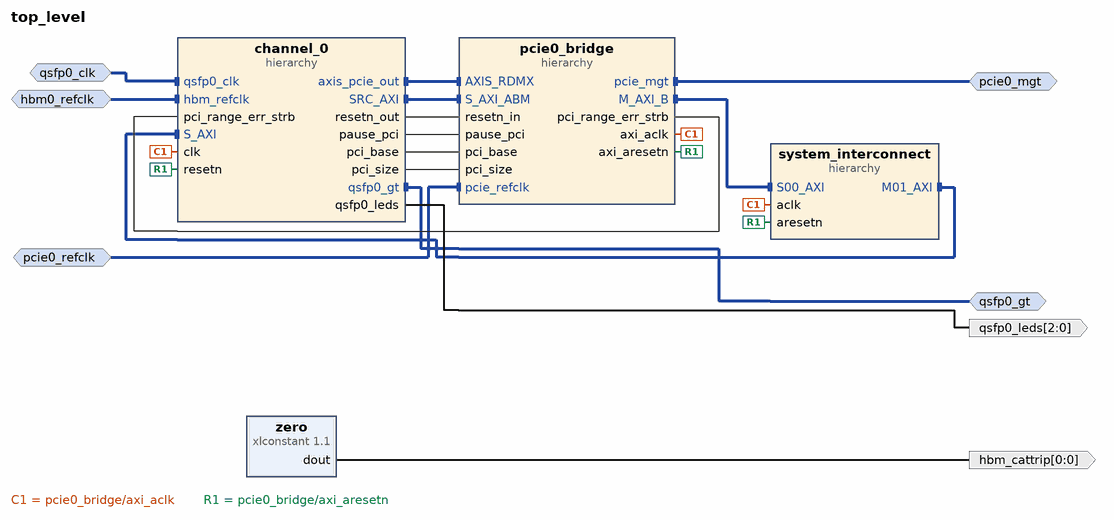
[diagram p0: block diagram of the top level]
# Vivado block design top_level, xcu55c-fsvh2892-2L-e, Vivado 2021.1
create_bd_design top_level

create_bd_intf_port -mode Slave -vlnv xilinx.com:interface:diff_clock_rtl:1.0 pcie0_refclk
create_bd_intf_port -mode Master -vlnv xilinx.com:interface:pcie_7x_mgt_rtl:1.0 pcie0_mgt
create_bd_intf_port -mode Slave -vlnv xilinx.com:interface:diff_clock_rtl:1.0 qsfp0_clk
set_property -dict {CONFIG.FREQ_HZ 161132812} [get_bd_intf_ports qsfp0_clk]
create_bd_intf_port -mode Master -vlnv xilinx.com:interface:gt_rtl:1.0 qsfp0_gt
create_bd_intf_port -mode Slave -vlnv xilinx.com:interface:diff_clock_rtl:1.0 hbm0_refclk
create_bd_port -dir O -from 0 -to 0 hbm_cattrip
create_bd_port -dir O -from 2 -to 0 qsfp0_leds

create_bd_cell -type hier pcie0_bridge
create_bd_cell -type hier system_interconnect
create_bd_cell -type ip -vlnv xilinx.com:ip:xlconstant:1.1 zero
set_property -dict {CONFIG.CONST_VAL 0} [get_bd_cells zero]
create_bd_cell -type hier channel_0

# ---- hierarchy /pcie0_bridge ----
current_bd_instance /pcie0_bridge
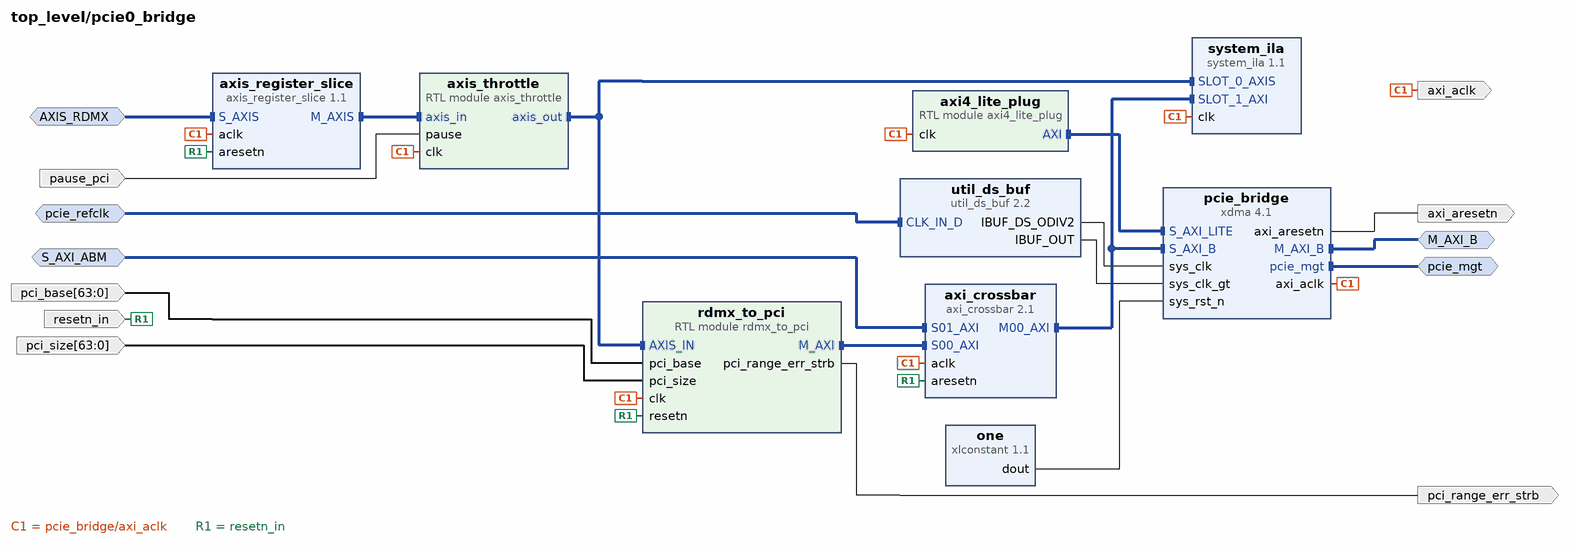
[diagram p1: block diagram inside /pcie0_bridge]
create_bd_intf_pin -mode Master -vlnv xilinx.com:interface:pcie_7x_mgt_rtl:1.0 pcie_mgt
create_bd_intf_pin -mode Slave -vlnv xilinx.com:interface:diff_clock_rtl:1.0 pcie_refclk
create_bd_intf_pin -mode Master -vlnv xilinx.com:interface:aximm_rtl:1.0 M_AXI_B
create_bd_intf_pin -mode Slave -vlnv xilinx.com:interface:axis_rtl:1.0 AXIS_RDMX
create_bd_intf_pin -mode Slave -vlnv xilinx.com:interface:aximm_rtl:1.0 S_AXI_ABM
create_bd_pin -dir O axi_aclk
create_bd_pin -dir O axi_aresetn
create_bd_pin -dir I resetn_in
create_bd_pin -dir O pci_range_err_strb
create_bd_pin -dir I pause_pci
create_bd_pin -dir I -from 63 -to 0 pci_base
create_bd_pin -dir I -from 63 -to 0 pci_size

create_bd_cell -type ip -vlnv xilinx.com:ip:axi_crossbar:2.1 axi_crossbar
set_property -dict [list \
  CONFIG.M00_A01_BASE_ADDR 0xffffffffffffffff \
  CONFIG.M00_A02_BASE_ADDR 0xffffffffffffffff \
  CONFIG.M00_A03_BASE_ADDR 0xffffffffffffffff \
  CONFIG.M00_A04_BASE_ADDR 0xffffffffffffffff \
  CONFIG.M00_A05_BASE_ADDR 0xffffffffffffffff \
  CONFIG.M00_A06_BASE_ADDR 0xffffffffffffffff \
  CONFIG.M00_A07_BASE_ADDR 0xffffffffffffffff \
  CONFIG.M00_A08_BASE_ADDR 0xffffffffffffffff \
  CONFIG.M00_A09_BASE_ADDR 0xffffffffffffffff \
  CONFIG.M00_A10_BASE_ADDR 0xffffffffffffffff \
  CONFIG.M00_A11_BASE_ADDR 0xffffffffffffffff \
  CONFIG.M00_A12_BASE_ADDR 0xffffffffffffffff \
  CONFIG.M00_A13_BASE_ADDR 0xffffffffffffffff \
  CONFIG.M00_A14_BASE_ADDR 0xffffffffffffffff \
  CONFIG.M00_A15_BASE_ADDR 0xffffffffffffffff \
  CONFIG.M00_S00_READ_CONNECTIVITY 0 \
  CONFIG.M00_S00_WRITE_CONNECTIVITY 1 \
  CONFIG.M00_S01_READ_CONNECTIVITY 1 \
  CONFIG.M00_S01_WRITE_CONNECTIVITY 0 \
  CONFIG.M01_A00_ADDR_WIDTH 0 \
  CONFIG.M01_A00_BASE_ADDR 0xffffffffffffffff \
  CONFIG.M01_A01_BASE_ADDR 0xffffffffffffffff \
  CONFIG.M01_A02_BASE_ADDR 0xffffffffffffffff \
  CONFIG.M01_A03_BASE_ADDR 0xffffffffffffffff \
  CONFIG.M01_A04_BASE_ADDR 0xffffffffffffffff \
  CONFIG.M01_A05_BASE_ADDR 0xffffffffffffffff \
  CONFIG.M01_A06_BASE_ADDR 0xffffffffffffffff \
  CONFIG.M01_A07_BASE_ADDR 0xffffffffffffffff \
  CONFIG.M01_A08_BASE_ADDR 0xffffffffffffffff \
  CONFIG.M01_A09_BASE_ADDR 0xffffffffffffffff \
  CONFIG.M01_A10_BASE_ADDR 0xffffffffffffffff \
  CONFIG.M01_A11_BASE_ADDR 0xffffffffffffffff \
  CONFIG.M01_A12_BASE_ADDR 0xffffffffffffffff \
  CONFIG.M01_A13_BASE_ADDR 0xffffffffffffffff \
  CONFIG.M01_A14_BASE_ADDR 0xffffffffffffffff \
  CONFIG.M01_A15_BASE_ADDR 0xffffffffffffffff \
  CONFIG.M02_A00_ADDR_WIDTH 0 \
  CONFIG.M02_A00_BASE_ADDR 0xffffffffffffffff \
  CONFIG.M02_A01_BASE_ADDR 0xffffffffffffffff \
  CONFIG.M02_A02_BASE_ADDR 0xffffffffffffffff \
  CONFIG.M02_A03_BASE_ADDR 0xffffffffffffffff \
  CONFIG.M02_A04_BASE_ADDR 0xffffffffffffffff \
  CONFIG.M02_A05_BASE_ADDR 0xffffffffffffffff \
  CONFIG.M02_A06_BASE_ADDR 0xffffffffffffffff \
  CONFIG.M02_A07_BASE_ADDR 0xffffffffffffffff \
  CONFIG.M02_A08_BASE_ADDR 0xffffffffffffffff \
  CONFIG.M02_A09_BASE_ADDR 0xffffffffffffffff \
  CONFIG.M02_A10_BASE_ADDR 0xffffffffffffffff \
  CONFIG.M02_A11_BASE_ADDR 0xffffffffffffffff \
  CONFIG.M02_A12_BASE_ADDR 0xffffffffffffffff \
  CONFIG.M02_A13_BASE_ADDR 0xffffffffffffffff \
  CONFIG.M02_A14_BASE_ADDR 0xffffffffffffffff \
  CONFIG.M02_A15_BASE_ADDR 0xffffffffffffffff \
  CONFIG.M03_A00_ADDR_WIDTH 0 \
  CONFIG.M03_A00_BASE_ADDR 0xffffffffffffffff \
  CONFIG.M03_A01_BASE_ADDR 0xffffffffffffffff \
  CONFIG.M03_A02_BASE_ADDR 0xffffffffffffffff \
  CONFIG.M03_A03_BASE_ADDR 0xffffffffffffffff \
  CONFIG.M03_A04_BASE_ADDR 0xffffffffffffffff \
  CONFIG.M03_A05_BASE_ADDR 0xffffffffffffffff \
  CONFIG.M03_A06_BASE_ADDR 0xffffffffffffffff \
  CONFIG.M03_A07_BASE_ADDR 0xffffffffffffffff \
  CONFIG.M03_A08_BASE_ADDR 0xffffffffffffffff \
  CONFIG.M03_A09_BASE_ADDR 0xffffffffffffffff \
  CONFIG.M03_A10_BASE_ADDR 0xffffffffffffffff \
  CONFIG.M03_A11_BASE_ADDR 0xffffffffffffffff \
  CONFIG.M03_A12_BASE_ADDR 0xffffffffffffffff \
  CONFIG.M03_A13_BASE_ADDR 0xffffffffffffffff \
  CONFIG.M03_A14_BASE_ADDR 0xffffffffffffffff \
  CONFIG.M03_A15_BASE_ADDR 0xffffffffffffffff \
  CONFIG.M04_A00_ADDR_WIDTH 0 \
  CONFIG.M04_A00_BASE_ADDR 0xffffffffffffffff \
  CONFIG.M04_A01_BASE_ADDR 0xffffffffffffffff \
  CONFIG.M04_A02_BASE_ADDR 0xffffffffffffffff \
  CONFIG.M04_A03_BASE_ADDR 0xffffffffffffffff \
  CONFIG.M04_A04_BASE_ADDR 0xffffffffffffffff \
  CONFIG.M04_A05_BASE_ADDR 0xffffffffffffffff \
  CONFIG.M04_A06_BASE_ADDR 0xffffffffffffffff \
  CONFIG.M04_A07_BASE_ADDR 0xffffffffffffffff \
  CONFIG.M04_A08_BASE_ADDR 0xffffffffffffffff \
  CONFIG.M04_A09_BASE_ADDR 0xffffffffffffffff \
  CONFIG.M04_A10_BASE_ADDR 0xffffffffffffffff \
  CONFIG.M04_A11_BASE_ADDR 0xffffffffffffffff \
  CONFIG.M04_A12_BASE_ADDR 0xffffffffffffffff \
  CONFIG.M04_A13_BASE_ADDR 0xffffffffffffffff \
  CONFIG.M04_A14_BASE_ADDR 0xffffffffffffffff \
  CONFIG.M04_A15_BASE_ADDR 0xffffffffffffffff \
  CONFIG.M05_A00_ADDR_WIDTH 0 \
  CONFIG.M05_A00_BASE_ADDR 0xffffffffffffffff \
  CONFIG.M05_A01_BASE_ADDR 0xffffffffffffffff \
  CONFIG.M05_A02_BASE_ADDR 0xffffffffffffffff \
  CONFIG.M05_A03_BASE_ADDR 0xffffffffffffffff \
  CONFIG.M05_A04_BASE_ADDR 0xffffffffffffffff \
  CONFIG.M05_A05_BASE_ADDR 0xffffffffffffffff \
  CONFIG.M05_A06_BASE_ADDR 0xffffffffffffffff \
  CONFIG.M05_A07_BASE_ADDR 0xffffffffffffffff \
  CONFIG.M05_A08_BASE_ADDR 0xffffffffffffffff \
  CONFIG.M05_A09_BASE_ADDR 0xffffffffffffffff \
  CONFIG.M05_A10_BASE_ADDR 0xffffffffffffffff \
  CONFIG.M05_A11_BASE_ADDR 0xffffffffffffffff \
  CONFIG.M05_A12_BASE_ADDR 0xffffffffffffffff \
  CONFIG.M05_A13_BASE_ADDR 0xffffffffffffffff \
  CONFIG.M05_A14_BASE_ADDR 0xffffffffffffffff \
  CONFIG.M05_A15_BASE_ADDR 0xffffffffffffffff \
  CONFIG.M06_A00_ADDR_WIDTH 0 \
  CONFIG.M06_A00_BASE_ADDR 0xffffffffffffffff \
  CONFIG.M06_A01_BASE_ADDR 0xffffffffffffffff \
  CONFIG.M06_A02_BASE_ADDR 0xffffffffffffffff \
  CONFIG.M06_A03_BASE_ADDR 0xffffffffffffffff \
  CONFIG.M06_A04_BASE_ADDR 0xffffffffffffffff \
  CONFIG.M06_A05_BASE_ADDR 0xffffffffffffffff \
  CONFIG.M06_A06_BASE_ADDR 0xffffffffffffffff \
  CONFIG.M06_A07_BASE_ADDR 0xffffffffffffffff \
  CONFIG.M06_A08_BASE_ADDR 0xffffffffffffffff \
  CONFIG.M06_A09_BASE_ADDR 0xffffffffffffffff \
  CONFIG.M06_A10_BASE_ADDR 0xffffffffffffffff \
  CONFIG.M06_A11_BASE_ADDR 0xffffffffffffffff \
  CONFIG.M06_A12_BASE_ADDR 0xffffffffffffffff \
  CONFIG.M06_A13_BASE_ADDR 0xffffffffffffffff \
  CONFIG.M06_A14_BASE_ADDR 0xffffffffffffffff \
  CONFIG.M06_A15_BASE_ADDR 0xffffffffffffffff \
  CONFIG.M07_A00_ADDR_WIDTH 0 \
  CONFIG.M07_A00_BASE_ADDR 0xffffffffffffffff \
  CONFIG.M07_A01_BASE_ADDR 0xffffffffffffffff \
  CONFIG.M07_A02_BASE_ADDR 0xffffffffffffffff \
  CONFIG.M07_A03_BASE_ADDR 0xffffffffffffffff \
  CONFIG.M07_A04_BASE_ADDR 0xffffffffffffffff \
  CONFIG.M07_A05_BASE_ADDR 0xffffffffffffffff \
  CONFIG.M07_A06_BASE_ADDR 0xffffffffffffffff \
  CONFIG.M07_A07_BASE_ADDR 0xffffffffffffffff \
  CONFIG.M07_A08_BASE_ADDR 0xffffffffffffffff \
  CONFIG.M07_A09_BASE_ADDR 0xffffffffffffffff \
  CONFIG.M07_A10_BASE_ADDR 0xffffffffffffffff \
  CONFIG.M07_A11_BASE_ADDR 0xffffffffffffffff \
  CONFIG.M07_A12_BASE_ADDR 0xffffffffffffffff \
  CONFIG.M07_A13_BASE_ADDR 0xffffffffffffffff \
  CONFIG.M07_A14_BASE_ADDR 0xffffffffffffffff \
  CONFIG.M07_A15_BASE_ADDR 0xffffffffffffffff \
  CONFIG.M08_A00_ADDR_WIDTH 0 \
  CONFIG.M08_A00_BASE_ADDR 0xffffffffffffffff \
  CONFIG.M08_A01_BASE_ADDR 0xffffffffffffffff \
  CONFIG.M08_A02_BASE_ADDR 0xffffffffffffffff \
  CONFIG.M08_A03_BASE_ADDR 0xffffffffffffffff \
  CONFIG.M08_A04_BASE_ADDR 0xffffffffffffffff \
  CONFIG.M08_A05_BASE_ADDR 0xffffffffffffffff \
  CONFIG.M08_A06_BASE_ADDR 0xffffffffffffffff \
  CONFIG.M08_A07_BASE_ADDR 0xffffffffffffffff \
  CONFIG.M08_A08_BASE_ADDR 0xffffffffffffffff \
  CONFIG.M08_A09_BASE_ADDR 0xffffffffffffffff \
  CONFIG.M08_A10_BASE_ADDR 0xffffffffffffffff \
  CONFIG.M08_A11_BASE_ADDR 0xffffffffffffffff \
  CONFIG.M08_A12_BASE_ADDR 0xffffffffffffffff \
  CONFIG.M08_A13_BASE_ADDR 0xffffffffffffffff \
  CONFIG.M08_A14_BASE_ADDR 0xffffffffffffffff \
  CONFIG.M08_A15_BASE_ADDR 0xffffffffffffffff \
  CONFIG.M09_A00_ADDR_WIDTH 0 \
  CONFIG.M09_A00_BASE_ADDR 0xffffffffffffffff \
  CONFIG.M09_A01_BASE_ADDR 0xffffffffffffffff \
  CONFIG.M09_A02_BASE_ADDR 0xffffffffffffffff \
  CONFIG.M09_A03_BASE_ADDR 0xffffffffffffffff \
  CONFIG.M09_A04_BASE_ADDR 0xffffffffffffffff \
  CONFIG.M09_A05_BASE_ADDR 0xffffffffffffffff \
  CONFIG.M09_A06_BASE_ADDR 0xffffffffffffffff \
  CONFIG.M09_A07_BASE_ADDR 0xffffffffffffffff \
  CONFIG.M09_A08_BASE_ADDR 0xffffffffffffffff \
  CONFIG.M09_A09_BASE_ADDR 0xffffffffffffffff \
  CONFIG.M09_A10_BASE_ADDR 0xffffffffffffffff \
  CONFIG.M09_A11_BASE_ADDR 0xffffffffffffffff \
  CONFIG.M09_A12_BASE_ADDR 0xffffffffffffffff \
  CONFIG.M09_A13_BASE_ADDR 0xffffffffffffffff \
  CONFIG.M09_A14_BASE_ADDR 0xffffffffffffffff \
  CONFIG.M09_A15_BASE_ADDR 0xffffffffffffffff \
  CONFIG.M10_A00_ADDR_WIDTH 0 \
  CONFIG.M10_A00_BASE_ADDR 0xffffffffffffffff \
  CONFIG.M10_A01_BASE_ADDR 0xffffffffffffffff \
  CONFIG.M10_A02_BASE_ADDR 0xffffffffffffffff \
  CONFIG.M10_A03_BASE_ADDR 0xffffffffffffffff \
  CONFIG.M10_A04_BASE_ADDR 0xffffffffffffffff \
  CONFIG.M10_A05_BASE_ADDR 0xffffffffffffffff \
  CONFIG.M10_A06_BASE_ADDR 0xffffffffffffffff \
  CONFIG.M10_A07_BASE_ADDR 0xffffffffffffffff \
  CONFIG.M10_A08_BASE_ADDR 0xffffffffffffffff \
  CONFIG.M10_A09_BASE_ADDR 0xffffffffffffffff \
  CONFIG.M10_A10_BASE_ADDR 0xffffffffffffffff \
  CONFIG.M10_A11_BASE_ADDR 0xffffffffffffffff \
  CONFIG.M10_A12_BASE_ADDR 0xffffffffffffffff \
  CONFIG.M10_A13_BASE_ADDR 0xffffffffffffffff \
  CONFIG.M10_A14_BASE_ADDR 0xffffffffffffffff \
  CONFIG.M10_A15_BASE_ADDR 0xffffffffffffffff \
  CONFIG.M11_A00_ADDR_WIDTH 0 \
  CONFIG.M11_A00_BASE_ADDR 0xffffffffffffffff \
  CONFIG.M11_A01_BASE_ADDR 0xffffffffffffffff \
  CONFIG.M11_A02_BASE_ADDR 0xffffffffffffffff \
  CONFIG.M11_A03_BASE_ADDR 0xffffffffffffffff \
  CONFIG.M11_A04_BASE_ADDR 0xffffffffffffffff \
  CONFIG.M11_A05_BASE_ADDR 0xffffffffffffffff \
  CONFIG.M11_A06_BASE_ADDR 0xffffffffffffffff \
  CONFIG.M11_A07_BASE_ADDR 0xffffffffffffffff \
  CONFIG.M11_A08_BASE_ADDR 0xffffffffffffffff \
  CONFIG.M11_A09_BASE_ADDR 0xffffffffffffffff \
  CONFIG.M11_A10_BASE_ADDR 0xffffffffffffffff \
  CONFIG.M11_A11_BASE_ADDR 0xffffffffffffffff \
  CONFIG.M11_A12_BASE_ADDR 0xffffffffffffffff \
  CONFIG.M11_A13_BASE_ADDR 0xffffffffffffffff \
  CONFIG.M11_A14_BASE_ADDR 0xffffffffffffffff \
  CONFIG.M11_A15_BASE_ADDR 0xffffffffffffffff \
  CONFIG.M12_A00_ADDR_WIDTH 0 \
  CONFIG.M12_A00_BASE_ADDR 0xffffffffffffffff \
  CONFIG.M12_A01_BASE_ADDR 0xffffffffffffffff \
  CONFIG.M12_A02_BASE_ADDR 0xffffffffffffffff \
  CONFIG.M12_A03_BASE_ADDR 0xffffffffffffffff \
  CONFIG.M12_A04_BASE_ADDR 0xffffffffffffffff \
  CONFIG.M12_A05_BASE_ADDR 0xffffffffffffffff \
  CONFIG.M12_A06_BASE_ADDR 0xffffffffffffffff \
  CONFIG.M12_A07_BASE_ADDR 0xffffffffffffffff \
  CONFIG.M12_A08_BASE_ADDR 0xffffffffffffffff \
  CONFIG.M12_A09_BASE_ADDR 0xffffffffffffffff \
  CONFIG.M12_A10_BASE_ADDR 0xffffffffffffffff \
  CONFIG.M12_A11_BASE_ADDR 0xffffffffffffffff \
  CONFIG.M12_A12_BASE_ADDR 0xffffffffffffffff \
  CONFIG.M12_A13_BASE_ADDR 0xffffffffffffffff \
  CONFIG.M12_A14_BASE_ADDR 0xffffffffffffffff \
  CONFIG.M12_A15_BASE_ADDR 0xffffffffffffffff \
  CONFIG.M13_A00_ADDR_WIDTH 0 \
  CONFIG.M13_A00_BASE_ADDR 0xffffffffffffffff \
  CONFIG.M13_A01_BASE_ADDR 0xffffffffffffffff \
  CONFIG.M13_A02_BASE_ADDR 0xffffffffffffffff \
  CONFIG.M13_A03_BASE_ADDR 0xffffffffffffffff \
  CONFIG.M13_A04_BASE_ADDR 0xffffffffffffffff \
  CONFIG.M13_A05_BASE_ADDR 0xffffffffffffffff \
  CONFIG.M13_A06_BASE_ADDR 0xffffffffffffffff \
  CONFIG.M13_A07_BASE_ADDR 0xffffffffffffffff \
  CONFIG.M13_A08_BASE_ADDR 0xffffffffffffffff \
  CONFIG.M13_A09_BASE_ADDR 0xffffffffffffffff \
  CONFIG.M13_A10_BASE_ADDR 0xffffffffffffffff \
  CONFIG.M13_A11_BASE_ADDR 0xffffffffffffffff \
  CONFIG.M13_A12_BASE_ADDR 0xffffffffffffffff \
  CONFIG.M13_A13_BASE_ADDR 0xffffffffffffffff \
  CONFIG.M13_A14_BASE_ADDR 0xffffffffffffffff \
  CONFIG.M13_A15_BASE_ADDR 0xffffffffffffffff \
  CONFIG.M14_A00_ADDR_WIDTH 0 \
  CONFIG.M14_A00_BASE_ADDR 0xffffffffffffffff \
  CONFIG.M14_A01_BASE_ADDR 0xffffffffffffffff \
  CONFIG.M14_A02_BASE_ADDR 0xffffffffffffffff \
  CONFIG.M14_A03_BASE_ADDR 0xffffffffffffffff \
  CONFIG.M14_A04_BASE_ADDR 0xffffffffffffffff \
  CONFIG.M14_A05_BASE_ADDR 0xffffffffffffffff \
  CONFIG.M14_A06_BASE_ADDR 0xffffffffffffffff \
  CONFIG.M14_A07_BASE_ADDR 0xffffffffffffffff \
  CONFIG.M14_A08_BASE_ADDR 0xffffffffffffffff \
  CONFIG.M14_A09_BASE_ADDR 0xffffffffffffffff \
  CONFIG.M14_A10_BASE_ADDR 0xffffffffffffffff \
  CONFIG.M14_A11_BASE_ADDR 0xffffffffffffffff \
  CONFIG.M14_A12_BASE_ADDR 0xffffffffffffffff \
  CONFIG.M14_A13_BASE_ADDR 0xffffffffffffffff \
  CONFIG.M14_A14_BASE_ADDR 0xffffffffffffffff \
  CONFIG.M14_A15_BASE_ADDR 0xffffffffffffffff \
  CONFIG.M15_A00_ADDR_WIDTH 0 \
  CONFIG.M15_A00_BASE_ADDR 0xffffffffffffffff \
  CONFIG.M15_A01_BASE_ADDR 0xffffffffffffffff \
  CONFIG.M15_A02_BASE_ADDR 0xffffffffffffffff \
  CONFIG.M15_A03_BASE_ADDR 0xffffffffffffffff \
  CONFIG.M15_A04_BASE_ADDR 0xffffffffffffffff \
  CONFIG.M15_A05_BASE_ADDR 0xffffffffffffffff \
  CONFIG.M15_A06_BASE_ADDR 0xffffffffffffffff \
  CONFIG.M15_A07_BASE_ADDR 0xffffffffffffffff \
  CONFIG.M15_A08_BASE_ADDR 0xffffffffffffffff \
  CONFIG.M15_A09_BASE_ADDR 0xffffffffffffffff \
  CONFIG.M15_A10_BASE_ADDR 0xffffffffffffffff \
  CONFIG.M15_A11_BASE_ADDR 0xffffffffffffffff \
  CONFIG.M15_A12_BASE_ADDR 0xffffffffffffffff \
  CONFIG.M15_A13_BASE_ADDR 0xffffffffffffffff \
  CONFIG.M15_A14_BASE_ADDR 0xffffffffffffffff \
  CONFIG.M15_A15_BASE_ADDR 0xffffffffffffffff \
  CONFIG.NUM_MI 1 \
  CONFIG.NUM_SI 2 \
  CONFIG.S01_BASE_ID 0x00000020 \
  CONFIG.S02_BASE_ID 0x00000040 \
  CONFIG.S02_THREAD_ID_WIDTH 5 \
  CONFIG.S03_BASE_ID 0x00000060 \
  CONFIG.S03_THREAD_ID_WIDTH 5 \
  CONFIG.S04_BASE_ID 0x00000080 \
  CONFIG.S04_THREAD_ID_WIDTH 5 \
  CONFIG.S05_BASE_ID 0x000000a0 \
  CONFIG.S05_THREAD_ID_WIDTH 5 \
  CONFIG.S06_BASE_ID 0x000000c0 \
  CONFIG.S06_THREAD_ID_WIDTH 5 \
  CONFIG.S07_BASE_ID 0x000000e0 \
  CONFIG.S07_THREAD_ID_WIDTH 5 \
  CONFIG.S08_BASE_ID 0x00000100 \
  CONFIG.S08_THREAD_ID_WIDTH 5 \
  CONFIG.S09_BASE_ID 0x00000120 \
  CONFIG.S09_THREAD_ID_WIDTH 5 \
  CONFIG.S10_BASE_ID 0x00000140 \
  CONFIG.S10_THREAD_ID_WIDTH 5 \
  CONFIG.S11_BASE_ID 0x00000160 \
  CONFIG.S11_THREAD_ID_WIDTH 5 \
  CONFIG.S12_BASE_ID 0x00000180 \
  CONFIG.S12_THREAD_ID_WIDTH 5 \
  CONFIG.S13_BASE_ID 0x000001a0 \
  CONFIG.S13_THREAD_ID_WIDTH 5 \
  CONFIG.S14_BASE_ID 0x000001c0 \
  CONFIG.S14_THREAD_ID_WIDTH 5 \
  CONFIG.S15_BASE_ID 0x000001e0 \
  CONFIG.S15_THREAD_ID_WIDTH 5 \
] [get_bd_cells axi_crossbar]
create_bd_cell -type ip -vlnv xilinx.com:ip:axis_register_slice:1.1 axis_register_slice
set_property -dict {CONFIG.REG_CONFIG 8} [get_bd_cells axis_register_slice]
create_bd_cell -type module -reference axis_throttle axis_throttle
create_bd_cell -type module -reference rdmx_to_pci rdmx_to_pci
create_bd_cell -type ip -vlnv xilinx.com:ip:system_ila:1.1 system_ila
set_property -dict [list \
  CONFIG.C_MON_TYPE INTERFACE \
  CONFIG.C_NUM_MONITOR_SLOTS 2 \
  CONFIG.C_SLOT_0_INTF_TYPE xilinx.com:interface:axis_rtl:1.0 \
] [get_bd_cells system_ila]
create_bd_cell -type ip -vlnv xilinx.com:ip:util_ds_buf:2.2 util_ds_buf
set_property -dict {CONFIG.C_BUF_TYPE IBUFDSGTE} [get_bd_cells util_ds_buf]
create_bd_cell -type ip -vlnv xilinx.com:ip:xdma:4.1 pcie_bridge
set_property -dict [list \
  CONFIG.PF0_DEVICE_ID_mqdma 9048 \
  CONFIG.PF0_SRIOV_VF_DEVICE_ID A048 \
  CONFIG.PF2_DEVICE_ID_mqdma 9248 \
  CONFIG.PF3_DEVICE_ID_mqdma 9348 \
  CONFIG.axi_addr_width 64 \
  CONFIG.axi_data_width 512_bit \
  CONFIG.axisten_freq 250 \
  CONFIG.bridge_burst true \
  CONFIG.en_axi_slave_if true \
  CONFIG.functional_mode AXI_Bridge \
  CONFIG.mode_selection Advanced \
  CONFIG.pcie_blk_locn PCIE4C_X1Y0 \
  CONFIG.pf0_bar0_scale Megabytes \
  CONFIG.pf0_bar0_size 1 \
  CONFIG.pf0_device_id 903f \
  CONFIG.pl_link_cap_max_link_speed 16.0_GT/s \
  CONFIG.pl_link_cap_max_link_width X8 \
  CONFIG.xlnx_ref_board AU55C \
] [get_bd_cells pcie_bridge]
create_bd_cell -type ip -vlnv xilinx.com:ip:xlconstant:1.1 one
create_bd_cell -type module -reference axi4_lite_plug axi4_lite_plug

# ---- hierarchy /system_interconnect ----
current_bd_instance /system_interconnect
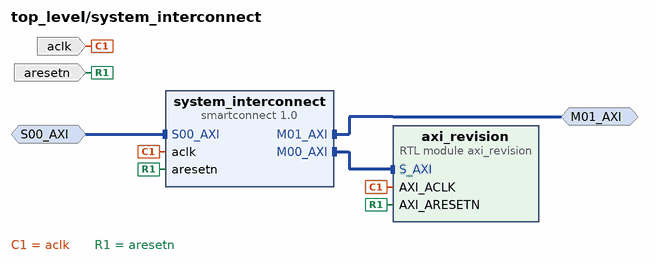
[diagram p2: block diagram inside /system_interconnect]
create_bd_intf_pin -mode Slave -vlnv xilinx.com:interface:aximm_rtl:1.0 S00_AXI
create_bd_intf_pin -mode Master -vlnv xilinx.com:interface:aximm_rtl:1.0 M01_AXI
create_bd_pin -dir I -type clk aclk
create_bd_pin -dir I -type rst aresetn

create_bd_cell -type module -reference axi_revision axi_revision
create_bd_cell -type ip -vlnv xilinx.com:ip:smartconnect:1.0 system_interconnect
set_property -dict {CONFIG.NUM_MI 2 CONFIG.NUM_SI 1} [get_bd_cells system_interconnect]

# ---- hierarchy /channel_0 ----
current_bd_instance /channel_0
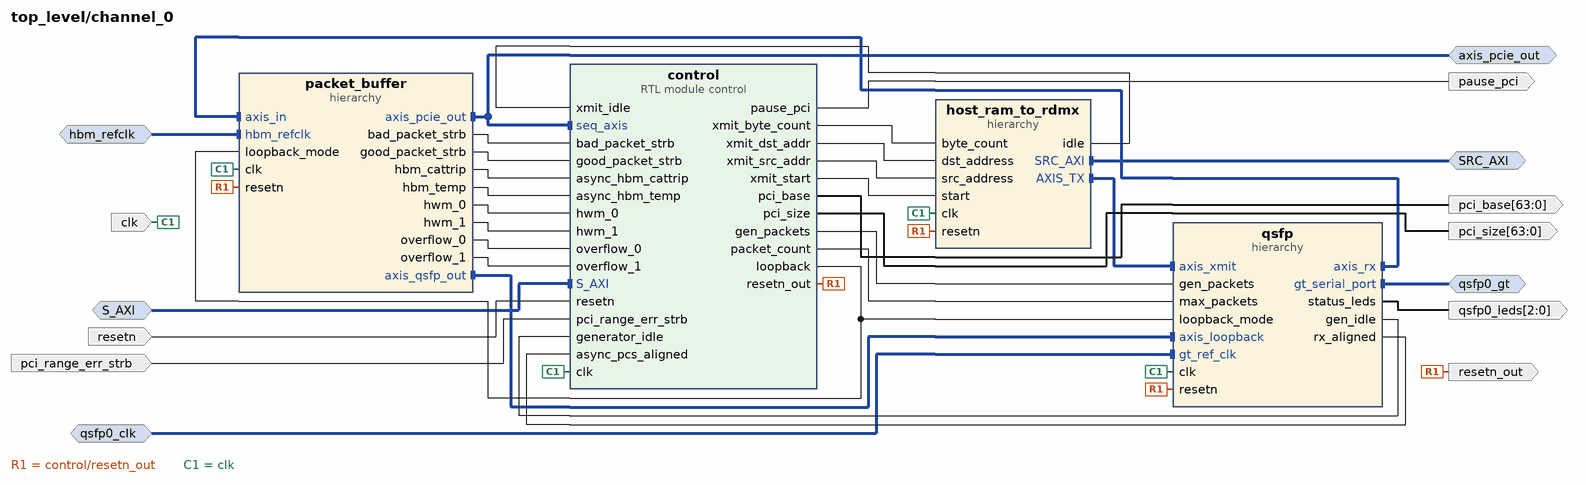
[diagram p3: block diagram inside /channel_0]
create_bd_intf_pin -mode Master -vlnv xilinx.com:interface:axis_rtl:1.0 axis_pcie_out
create_bd_intf_pin -mode Slave -vlnv xilinx.com:interface:aximm_rtl:1.0 S_AXI
create_bd_intf_pin -mode Master -vlnv xilinx.com:interface:aximm_rtl:1.0 SRC_AXI
create_bd_intf_pin -mode Slave -vlnv xilinx.com:interface:diff_clock_rtl:1.0 qsfp0_clk
create_bd_intf_pin -mode Master -vlnv xilinx.com:interface:gt_rtl:1.0 qsfp0_gt
create_bd_intf_pin -mode Slave -vlnv xilinx.com:interface:diff_clock_rtl:1.0 hbm_refclk
create_bd_pin -dir I -type clk clk
create_bd_pin -dir I -type rst resetn
create_bd_pin -dir O pause_pci
create_bd_pin -dir I pci_range_err_strb
create_bd_pin -dir O resetn_out
create_bd_pin -dir O -from 63 -to 0 pci_base
create_bd_pin -dir O -from 63 -to 0 pci_size
create_bd_pin -dir O -from 2 -to 0 qsfp0_leds

create_bd_cell -type hier host_ram_to_rdmx
create_bd_cell -type hier packet_buffer
create_bd_cell -type hier qsfp
create_bd_cell -type module -reference control control

# ---- hierarchy /channel_0/host_ram_to_rdmx ----
current_bd_instance /channel_0/host_ram_to_rdmx
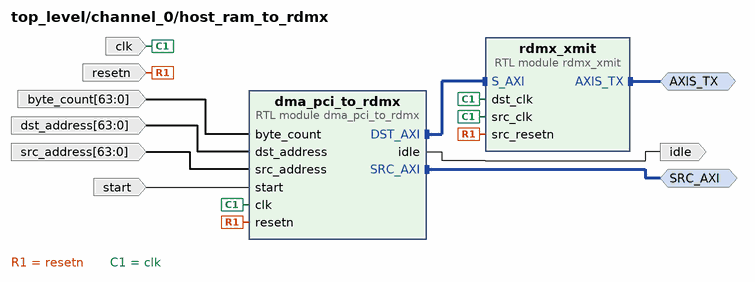
[diagram p4: block diagram inside /channel_0/host_ram_to_rdmx]
create_bd_intf_pin -mode Master -vlnv xilinx.com:interface:aximm_rtl:1.0 SRC_AXI
create_bd_intf_pin -mode Master -vlnv xilinx.com:interface:axis_rtl:1.0 AXIS_TX
create_bd_pin -dir I -type clk clk
create_bd_pin -dir I -type rst resetn
create_bd_pin -dir I -from 63 -to 0 src_address
create_bd_pin -dir I start
create_bd_pin -dir O idle
create_bd_pin -dir I -from 63 -to 0 dst_address
create_bd_pin -dir I -from 63 -to 0 byte_count

create_bd_cell -type module -reference rdmx_xmit rdmx_xmit
set_property -dict {CONFIG.FIFO_CLOCK_MODE common_clock} [get_bd_cells rdmx_xmit]
create_bd_cell -type module -reference dma_pci_to_rdmx dma_pci_to_rdmx

# ---- hierarchy /channel_0/packet_buffer ----
current_bd_instance /channel_0/packet_buffer
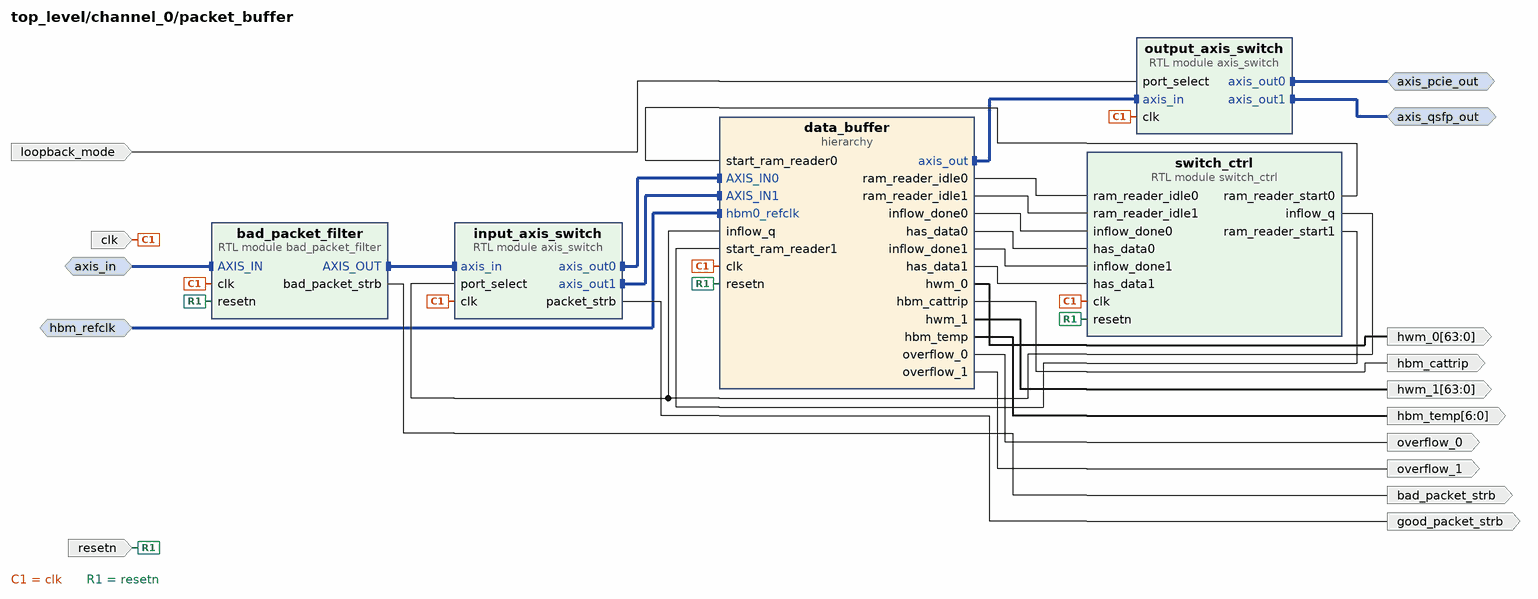
[diagram p5: block diagram inside /channel_0/packet_buffer]
create_bd_intf_pin -mode Slave -vlnv xilinx.com:interface:axis_rtl:1.0 axis_in
create_bd_intf_pin -mode Master -vlnv xilinx.com:interface:axis_rtl:1.0 axis_pcie_out
create_bd_intf_pin -mode Master -vlnv xilinx.com:interface:axis_rtl:1.0 axis_qsfp_out
create_bd_intf_pin -mode Slave -vlnv xilinx.com:interface:diff_clock_rtl:1.0 hbm_refclk
create_bd_pin -dir I -type clk clk
create_bd_pin -dir I resetn
create_bd_pin -dir O -from 63 -to 0 hwm_0
create_bd_pin -dir O -from 63 -to 0 hwm_1
create_bd_pin -dir I loopback_mode
create_bd_pin -dir O overflow_0
create_bd_pin -dir O overflow_1
create_bd_pin -dir O bad_packet_strb
create_bd_pin -dir O good_packet_strb
create_bd_pin -dir O -from 6 -to 0 hbm_temp
create_bd_pin -dir O hbm_cattrip

create_bd_cell -type module -reference axis_switch input_axis_switch
create_bd_cell -type module -reference axis_switch output_axis_switch
create_bd_cell -type module -reference switch_ctrl switch_ctrl
create_bd_cell -type hier data_buffer
create_bd_cell -type module -reference bad_packet_filter bad_packet_filter

# ---- hierarchy /channel_0/packet_buffer/data_buffer ----
current_bd_instance /channel_0/packet_buffer/data_buffer
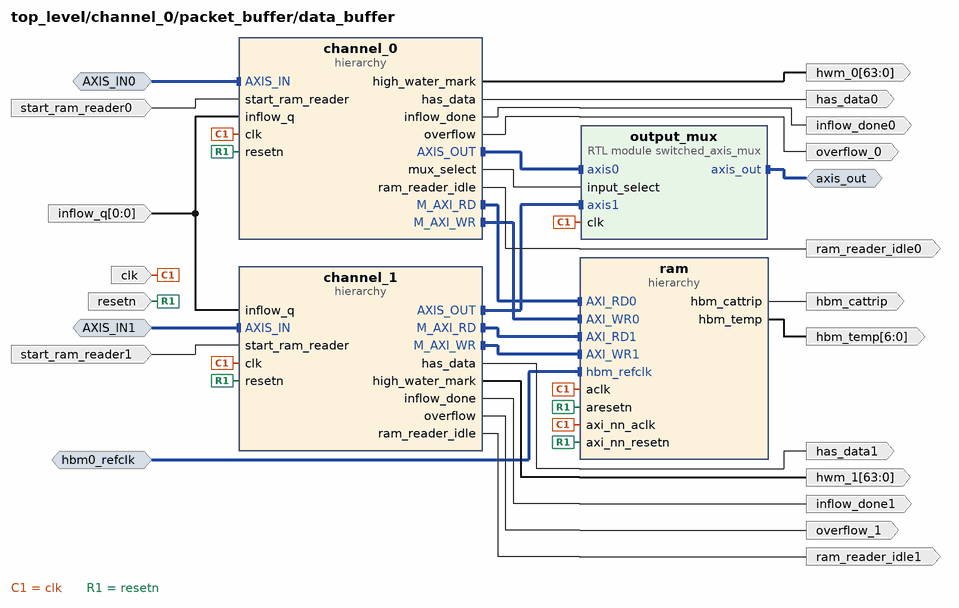
[diagram p6: block diagram inside /channel_0/packet_buffer/data_buffer]
create_bd_intf_pin -mode Slave -vlnv xilinx.com:interface:diff_clock_rtl:1.0 hbm0_refclk
create_bd_intf_pin -mode Slave -vlnv xilinx.com:interface:axis_rtl:1.0 AXIS_IN0
create_bd_intf_pin -mode Slave -vlnv xilinx.com:interface:axis_rtl:1.0 AXIS_IN1
create_bd_intf_pin -mode Master -vlnv xilinx.com:interface:axis_rtl:1.0 axis_out
create_bd_pin -dir I -type clk clk
create_bd_pin -dir I resetn
create_bd_pin -dir O -from 6 -to 0 hbm_temp
create_bd_pin -dir O hbm_cattrip
create_bd_pin -dir I -from 0 -to 0 inflow_q
create_bd_pin -dir O ram_reader_idle0
create_bd_pin -dir I start_ram_reader0
create_bd_pin -dir O has_data0
create_bd_pin -dir O inflow_done0
create_bd_pin -dir O -from 63 -to 0 hwm_0
create_bd_pin -dir O overflow_0
create_bd_pin -dir O has_data1
create_bd_pin -dir O inflow_done1
create_bd_pin -dir O -from 63 -to 0 hwm_1
create_bd_pin -dir O overflow_1
create_bd_pin -dir O ram_reader_idle1
create_bd_pin -dir I start_ram_reader1

create_bd_cell -type hier ram
create_bd_cell -type hier channel_0
create_bd_cell -type hier channel_1
create_bd_cell -type module -reference switched_axis_mux output_mux

# ---- hierarchy /channel_0/packet_buffer/data_buffer/ram ----
current_bd_instance /channel_0/packet_buffer/data_buffer/ram
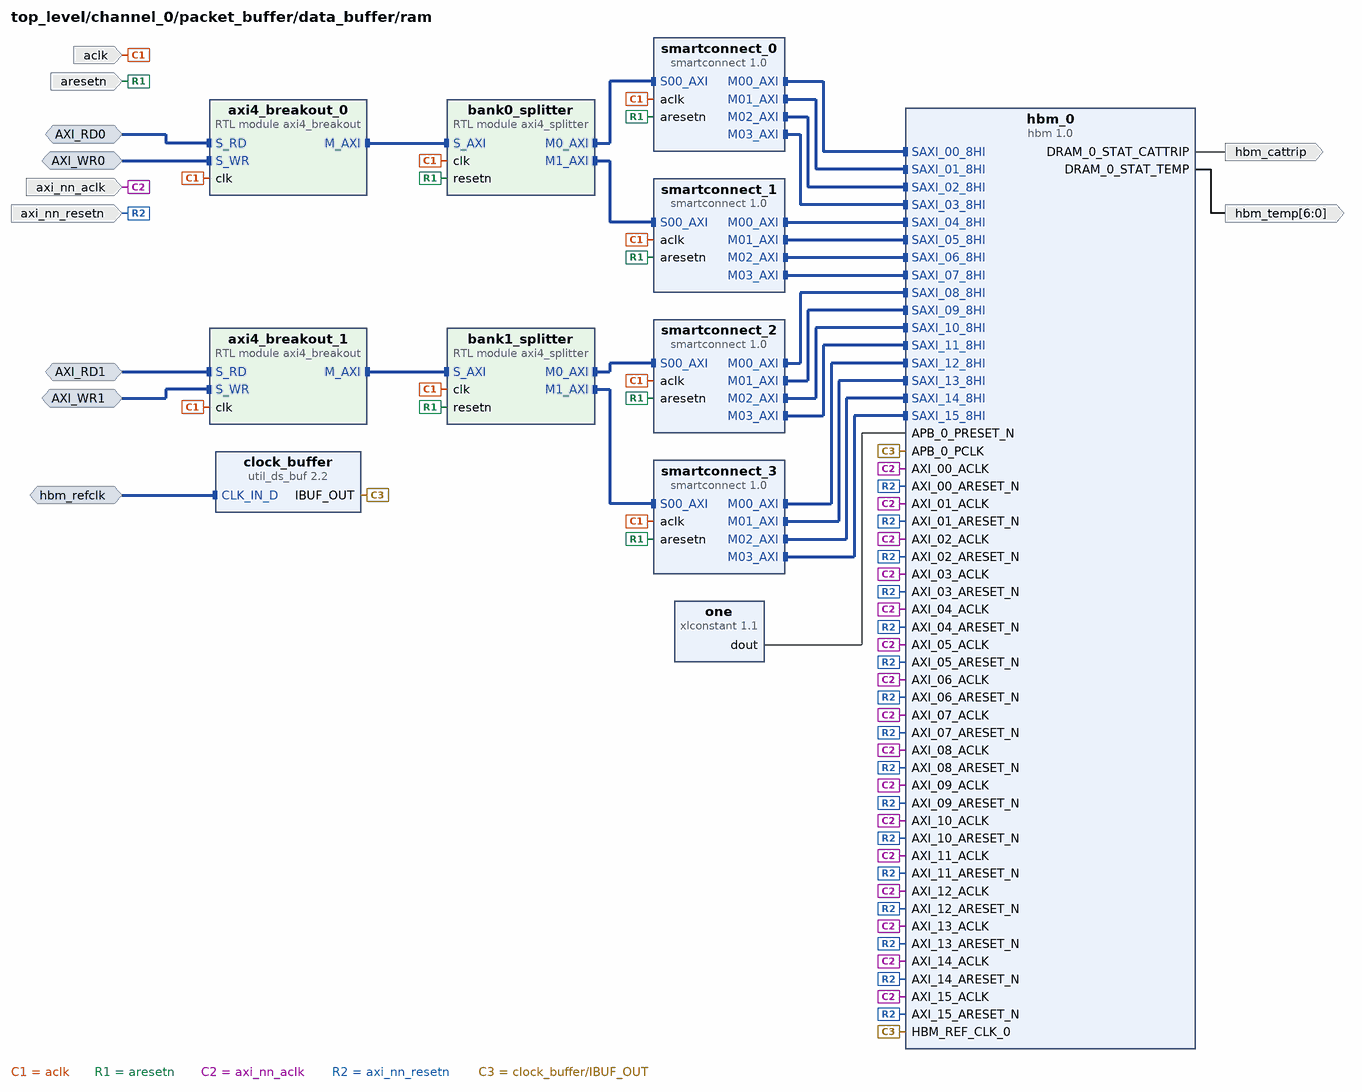
[diagram p7: block diagram inside /channel_0/packet_buffer/data_buffer/ram]
create_bd_intf_pin -mode Slave -vlnv xilinx.com:interface:aximm_rtl:1.0 AXI_WR1
create_bd_intf_pin -mode Slave -vlnv xilinx.com:interface:aximm_rtl:1.0 AXI_RD1
create_bd_intf_pin -mode Slave -vlnv xilinx.com:interface:aximm_rtl:1.0 AXI_WR0
create_bd_intf_pin -mode Slave -vlnv xilinx.com:interface:aximm_rtl:1.0 AXI_RD0
create_bd_intf_pin -mode Slave -vlnv xilinx.com:interface:diff_clock_rtl:1.0 hbm_refclk
create_bd_pin -dir I -type clk axi_nn_aclk
create_bd_pin -dir I axi_nn_resetn
create_bd_pin -dir O -from 6 -to 0 hbm_temp
create_bd_pin -dir O hbm_cattrip
create_bd_pin -dir I aclk
create_bd_pin -dir I aresetn

create_bd_cell -type ip -vlnv xilinx.com:ip:hbm:1.0 hbm_0
set_property -dict [list \
  CONFIG.USER_APB_EN false \
  CONFIG.USER_MC0_ENABLE_ECC_CORRECTION true \
  CONFIG.USER_MC0_TRAFFIC_OPTION Linear \
  CONFIG.USER_MC10_ENABLE_ECC_CORRECTION true \
  CONFIG.USER_MC10_TRAFFIC_OPTION Linear \
  CONFIG.USER_MC11_ENABLE_ECC_CORRECTION true \
  CONFIG.USER_MC11_TRAFFIC_OPTION Linear \
  CONFIG.USER_MC12_ENABLE_ECC_CORRECTION true \
  CONFIG.USER_MC12_TRAFFIC_OPTION Linear \
  CONFIG.USER_MC13_ENABLE_ECC_CORRECTION true \
  CONFIG.USER_MC13_TRAFFIC_OPTION Linear \
  CONFIG.USER_MC14_ENABLE_ECC_CORRECTION true \
  CONFIG.USER_MC14_TRAFFIC_OPTION Linear \
  CONFIG.USER_MC15_ENABLE_ECC_CORRECTION true \
  CONFIG.USER_MC15_TRAFFIC_OPTION Linear \
  CONFIG.USER_MC1_ENABLE_ECC_CORRECTION true \
  CONFIG.USER_MC1_TRAFFIC_OPTION Linear \
  CONFIG.USER_MC2_ENABLE_ECC_CORRECTION true \
  CONFIG.USER_MC2_TRAFFIC_OPTION Linear \
  CONFIG.USER_MC3_ENABLE_ECC_CORRECTION true \
  CONFIG.USER_MC3_TRAFFIC_OPTION Linear \
  CONFIG.USER_MC4_ENABLE_ECC_CORRECTION true \
  CONFIG.USER_MC4_TRAFFIC_OPTION Linear \
  CONFIG.USER_MC5_ENABLE_ECC_CORRECTION true \
  CONFIG.USER_MC5_TRAFFIC_OPTION Linear \
  CONFIG.USER_MC6_ENABLE_ECC_CORRECTION true \
  CONFIG.USER_MC6_TRAFFIC_OPTION Linear \
  CONFIG.USER_MC7_ENABLE_ECC_CORRECTION true \
  CONFIG.USER_MC7_TRAFFIC_OPTION Linear \
  CONFIG.USER_MC8_ENABLE_ECC_CORRECTION true \
  CONFIG.USER_MC8_TRAFFIC_OPTION Linear \
  CONFIG.USER_MC9_ENABLE_ECC_CORRECTION true \
  CONFIG.USER_MC9_TRAFFIC_OPTION Linear \
  CONFIG.USER_SWITCH_ENABLE_00 FALSE \
] [get_bd_cells hbm_0]
create_bd_cell -type ip -vlnv xilinx.com:ip:smartconnect:1.0 smartconnect_0
set_property -dict {CONFIG.NUM_MI 4 CONFIG.NUM_SI 1} [get_bd_cells smartconnect_0]
create_bd_cell -type ip -vlnv xilinx.com:ip:smartconnect:1.0 smartconnect_1
set_property -dict {CONFIG.NUM_MI 4 CONFIG.NUM_SI 1} [get_bd_cells smartconnect_1]
create_bd_cell -type ip -vlnv xilinx.com:ip:smartconnect:1.0 smartconnect_2
set_property -dict {CONFIG.NUM_MI 4 CONFIG.NUM_SI 1} [get_bd_cells smartconnect_2]
create_bd_cell -type ip -vlnv xilinx.com:ip:smartconnect:1.0 smartconnect_3
set_property -dict {CONFIG.NUM_MI 4 CONFIG.NUM_SI 1} [get_bd_cells smartconnect_3]
create_bd_cell -type ip -vlnv xilinx.com:ip:xlconstant:1.1 one
create_bd_cell -type ip -vlnv xilinx.com:ip:util_ds_buf:2.2 clock_buffer
create_bd_cell -type module -reference axi4_breakout axi4_breakout_0
create_bd_cell -type module -reference axi4_breakout axi4_breakout_1
create_bd_cell -type module -reference axi4_splitter bank0_splitter
set_property -dict {CONFIG.BASE_ADDR1 0x0000000080000000} [get_bd_cells bank0_splitter]
create_bd_cell -type module -reference axi4_splitter bank1_splitter
set_property -dict {CONFIG.BASE_ADDR0 0x0000000100000000 CONFIG.BASE_ADDR1 0x0000000180000000} [get_bd_cells bank1_splitter]

# ---- hierarchy /channel_0/packet_buffer/data_buffer/channel_0 ----
current_bd_instance /channel_0/packet_buffer/data_buffer/channel_0
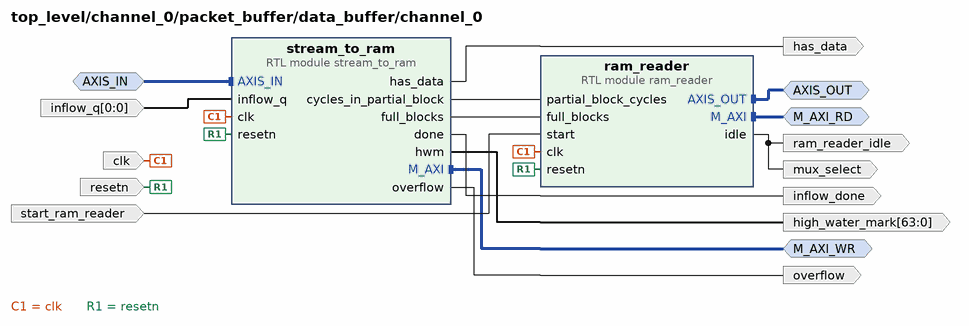
[diagram p8: block diagram inside /channel_0/packet_buffer/data_buffer/channel_0]
create_bd_intf_pin -mode Slave -vlnv xilinx.com:interface:axis_rtl:1.0 AXIS_IN
create_bd_intf_pin -mode Master -vlnv xilinx.com:interface:axis_rtl:1.0 AXIS_OUT
create_bd_intf_pin -mode Master -vlnv xilinx.com:interface:aximm_rtl:1.0 M_AXI_WR
create_bd_intf_pin -mode Master -vlnv xilinx.com:interface:aximm_rtl:1.0 M_AXI_RD
create_bd_pin -dir I -type clk clk
create_bd_pin -dir I resetn
create_bd_pin -dir I -from 0 -to 0 inflow_q
create_bd_pin -dir O ram_reader_idle
create_bd_pin -dir I start_ram_reader
create_bd_pin -dir O has_data
create_bd_pin -dir O inflow_done
create_bd_pin -dir O -from 63 -to 0 high_water_mark
create_bd_pin -dir O overflow
create_bd_pin -dir O mux_select

create_bd_cell -type module -reference stream_to_ram stream_to_ram
create_bd_cell -type module -reference ram_reader ram_reader

# ---- hierarchy /channel_0/packet_buffer/data_buffer/channel_1 ----
current_bd_instance /channel_0/packet_buffer/data_buffer/channel_1
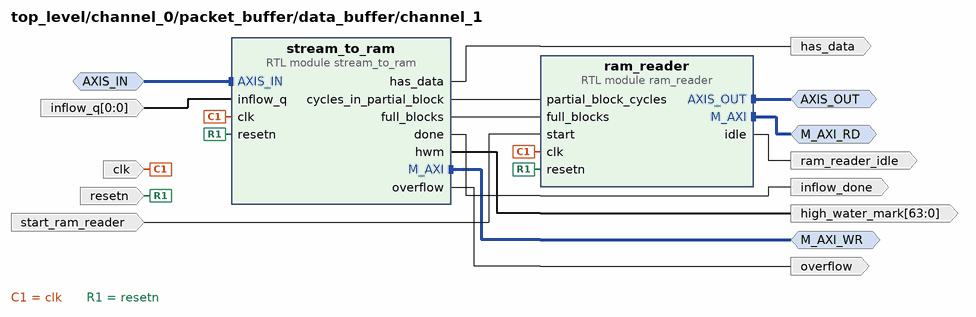
[diagram p9: block diagram inside /channel_0/packet_buffer/data_buffer/channel_1]
create_bd_intf_pin -mode Slave -vlnv xilinx.com:interface:axis_rtl:1.0 AXIS_IN
create_bd_intf_pin -mode Master -vlnv xilinx.com:interface:aximm_rtl:1.0 M_AXI_WR
create_bd_intf_pin -mode Master -vlnv xilinx.com:interface:axis_rtl:1.0 AXIS_OUT
create_bd_intf_pin -mode Master -vlnv xilinx.com:interface:aximm_rtl:1.0 M_AXI_RD
create_bd_pin -dir I -type clk clk
create_bd_pin -dir I resetn
create_bd_pin -dir I -from 0 -to 0 inflow_q
create_bd_pin -dir O has_data
create_bd_pin -dir O inflow_done
create_bd_pin -dir O -from 63 -to 0 high_water_mark
create_bd_pin -dir O overflow
create_bd_pin -dir O ram_reader_idle
create_bd_pin -dir I start_ram_reader

create_bd_cell -type module -reference stream_to_ram stream_to_ram
set_property -dict {CONFIG.CHANNEL 1} [get_bd_cells stream_to_ram]
create_bd_cell -type module -reference ram_reader ram_reader

# ---- hierarchy /channel_0/qsfp ----
current_bd_instance /channel_0/qsfp
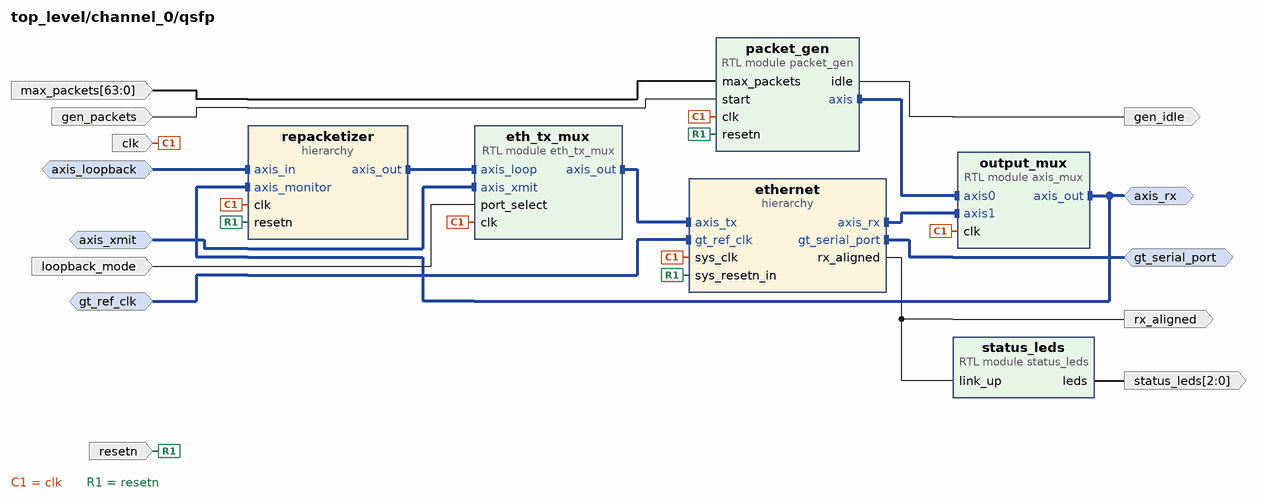
[diagram p10: block diagram inside /channel_0/qsfp]
create_bd_intf_pin -mode Master -vlnv xilinx.com:interface:axis_rtl:1.0 axis_rx
create_bd_intf_pin -mode Slave -vlnv xilinx.com:interface:diff_clock_rtl:1.0 gt_ref_clk
create_bd_intf_pin -mode Master -vlnv xilinx.com:interface:gt_rtl:1.0 gt_serial_port
create_bd_intf_pin -mode Slave -vlnv xilinx.com:interface:axis_rtl:1.0 axis_loopback
create_bd_intf_pin -mode Slave -vlnv xilinx.com:interface:axis_rtl:1.0 axis_xmit
create_bd_pin -dir I -type clk clk
create_bd_pin -dir I -type rst resetn
create_bd_pin -dir I gen_packets
create_bd_pin -dir I -from 63 -to 0 max_packets
create_bd_pin -dir O gen_idle
create_bd_pin -dir O rx_aligned
create_bd_pin -dir I loopback_mode
create_bd_pin -dir O -from 2 -to 0 status_leds

create_bd_cell -type hier ethernet
create_bd_cell -type hier repacketizer
create_bd_cell -type module -reference axis_mux output_mux
create_bd_cell -type module -reference eth_tx_mux eth_tx_mux
create_bd_cell -type module -reference packet_gen packet_gen
create_bd_cell -type module -reference status_leds status_leds

# ---- hierarchy /channel_0/qsfp/ethernet ----
current_bd_instance /channel_0/qsfp/ethernet
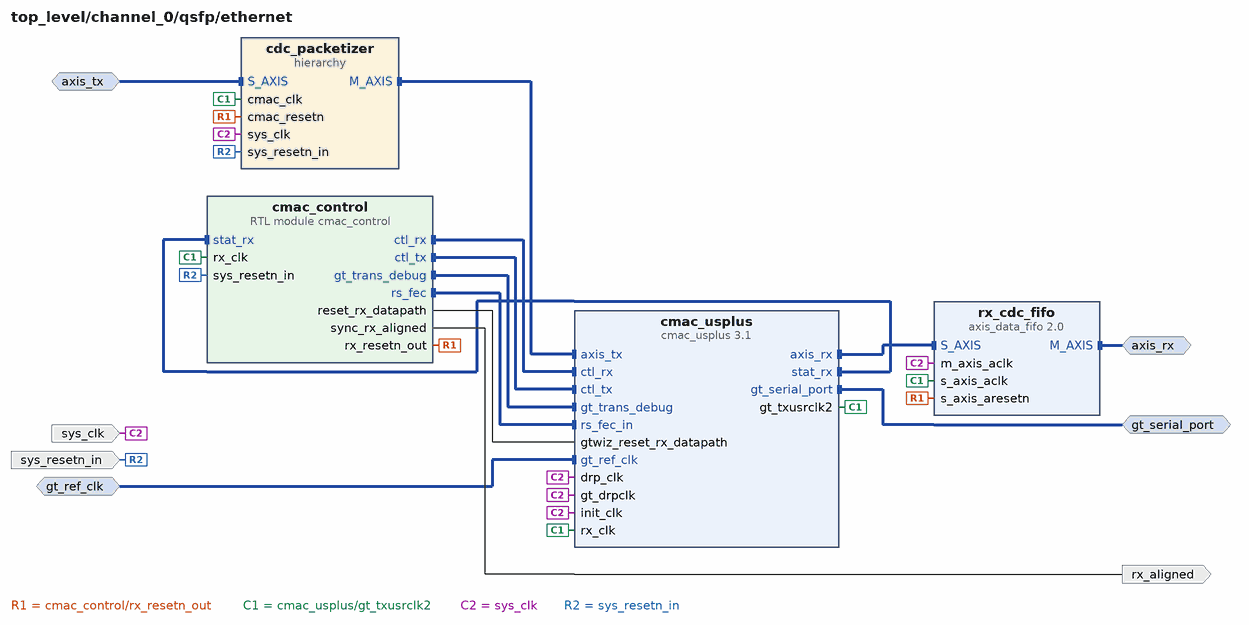
[diagram p11: block diagram inside /channel_0/qsfp/ethernet]
create_bd_intf_pin -mode Master -vlnv xilinx.com:interface:gt_rtl:1.0 gt_serial_port
create_bd_intf_pin -mode Slave -vlnv xilinx.com:interface:diff_clock_rtl:1.0 gt_ref_clk
create_bd_intf_pin -mode Master -vlnv xilinx.com:interface:axis_rtl:1.0 axis_rx
create_bd_intf_pin -mode Slave -vlnv xilinx.com:interface:axis_rtl:1.0 axis_tx
create_bd_pin -dir O rx_aligned
create_bd_pin -dir I sys_resetn_in
create_bd_pin -dir I sys_clk

create_bd_cell -type hier cdc_packetizer
create_bd_cell -type ip -vlnv xilinx.com:ip:axis_data_fifo:2.0 rx_cdc_fifo
set_property -dict {CONFIG.FIFO_DEPTH 16 CONFIG.IS_ACLK_ASYNC 1} [get_bd_cells rx_cdc_fifo]
create_bd_cell -type module -reference cmac_control cmac_control
create_bd_cell -type ip -vlnv xilinx.com:ip:cmac_usplus:3.1 cmac_usplus
set_property -dict [list \
  CONFIG.ADD_GT_CNRL_STS_PORTS 1 \
  CONFIG.CMAC_CAUI4_MODE 1 \
  CONFIG.CMAC_CORE_SELECT CMACE4_X0Y3 \
  CONFIG.GT_DRP_CLK 250 \
  CONFIG.GT_GROUP_SELECT {X0Y24~X0Y27} \
  CONFIG.GT_REF_CLK_FREQ 161.1328125 \
  CONFIG.INCLUDE_RS_FEC 1 \
  CONFIG.NUM_LANES 4x25 \
  CONFIG.RX_FLOW_CONTROL 0 \
  CONFIG.TX_FLOW_CONTROL 0 \
  CONFIG.USER_INTERFACE AXIS \
] [get_bd_cells cmac_usplus]

# ---- hierarchy /channel_0/qsfp/ethernet/cdc_packetizer ----
current_bd_instance /channel_0/qsfp/ethernet/cdc_packetizer
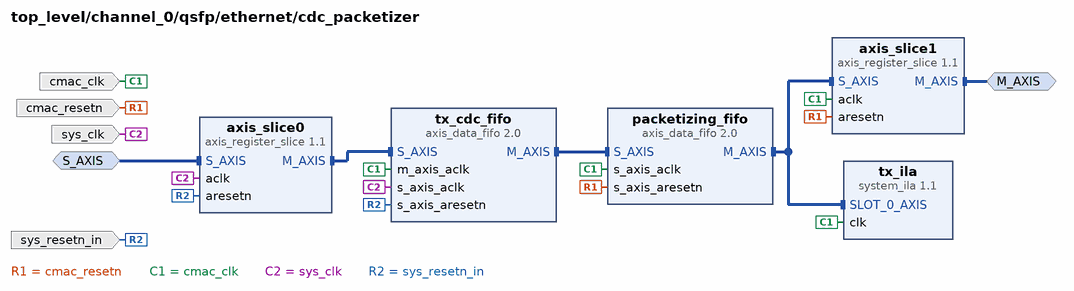
[diagram p12: block diagram inside /channel_0/qsfp/ethernet/cdc_packetizer]
create_bd_intf_pin -mode Slave -vlnv xilinx.com:interface:axis_rtl:1.0 S_AXIS
create_bd_intf_pin -mode Master -vlnv xilinx.com:interface:axis_rtl:1.0 M_AXIS
create_bd_pin -dir I sys_resetn_in
create_bd_pin -dir I sys_clk
create_bd_pin -dir I -type clk cmac_clk
create_bd_pin -dir I -type rst cmac_resetn

create_bd_cell -type ip -vlnv xilinx.com:ip:axis_data_fifo:2.0 tx_cdc_fifo
set_property -dict {CONFIG.FIFO_DEPTH 16 CONFIG.IS_ACLK_ASYNC 1} [get_bd_cells tx_cdc_fifo]
create_bd_cell -type ip -vlnv xilinx.com:ip:system_ila:1.1 tx_ila
set_property -dict {CONFIG.C_MON_TYPE INTERFACE CONFIG.C_SLOT_0_INTF_TYPE xilinx.com:interface:axis_rtl:1.0} [get_bd_cells tx_ila]
create_bd_cell -type ip -vlnv xilinx.com:ip:axis_data_fifo:2.0 packetizing_fifo
set_property -dict {CONFIG.FIFO_DEPTH 256 CONFIG.FIFO_MODE 2 CONFIG.IS_ACLK_ASYNC 0} [get_bd_cells packetizing_fifo]
create_bd_cell -type ip -vlnv xilinx.com:ip:axis_register_slice:1.1 axis_slice0
set_property -dict {CONFIG.REG_CONFIG 8} [get_bd_cells axis_slice0]
create_bd_cell -type ip -vlnv xilinx.com:ip:axis_register_slice:1.1 axis_slice1
set_property -dict {CONFIG.REG_CONFIG 8} [get_bd_cells axis_slice1]

# ---- hierarchy /channel_0/qsfp/repacketizer ----
current_bd_instance /channel_0/qsfp/repacketizer
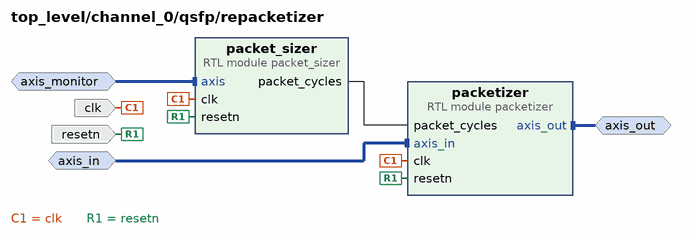
[diagram p13: block diagram inside /channel_0/qsfp/repacketizer]
create_bd_intf_pin -mode Monitor -vlnv xilinx.com:interface:axis_rtl:1.0 axis_monitor
create_bd_intf_pin -mode Slave -vlnv xilinx.com:interface:axis_rtl:1.0 axis_in
create_bd_intf_pin -mode Master -vlnv xilinx.com:interface:axis_rtl:1.0 axis_out
create_bd_pin -dir I -type clk clk
create_bd_pin -dir I -type rst resetn

create_bd_cell -type module -reference packet_sizer packet_sizer
create_bd_cell -type module -reference packetizer packetizer

# ---- connections ----

current_bd_instance /pcie0_bridge
connect_bd_intf_net [get_bd_intf_pins AXIS_RDMX] [get_bd_intf_pins axis_register_slice/S_AXIS]
connect_bd_intf_net [get_bd_intf_pins pcie_refclk] [get_bd_intf_pins util_ds_buf/CLK_IN_D]
connect_bd_intf_net [get_bd_intf_pins S_AXI_ABM] [get_bd_intf_pins axi_crossbar/S01_AXI]
connect_bd_intf_net [get_bd_intf_pins axi4_lite_plug/AXI] [get_bd_intf_pins pcie_bridge/S_AXI_LITE]
connect_bd_intf_net [get_bd_intf_pins axi_crossbar/M00_AXI] [get_bd_intf_pins pcie_bridge/S_AXI_B]
connect_bd_intf_net [get_bd_intf_pins axi_crossbar/M00_AXI] [get_bd_intf_pins system_ila/SLOT_1_AXI]
connect_bd_intf_net [get_bd_intf_pins axis_register_slice/M_AXIS] [get_bd_intf_pins axis_throttle/axis_in]
connect_bd_intf_net [get_bd_intf_pins axis_throttle/axis_out] [get_bd_intf_pins rdmx_to_pci/AXIS_IN]
connect_bd_intf_net [get_bd_intf_pins axis_throttle/axis_out] [get_bd_intf_pins system_ila/SLOT_0_AXIS]
connect_bd_intf_net [get_bd_intf_pins M_AXI_B] [get_bd_intf_pins pcie_bridge/M_AXI_B]
connect_bd_intf_net [get_bd_intf_pins pcie_mgt] [get_bd_intf_pins pcie_bridge/pcie_mgt]
connect_bd_intf_net [get_bd_intf_pins axi_crossbar/S00_AXI] [get_bd_intf_pins rdmx_to_pci/M_AXI]
connect_bd_net [get_bd_pins one/dout] [get_bd_pins pcie_bridge/sys_rst_n]
connect_bd_net -net pause_1 [get_bd_pins pause_pci] [get_bd_pins axis_throttle/pause]
connect_bd_net [get_bd_pins pci_base] [get_bd_pins rdmx_to_pci/pci_base]
connect_bd_net [get_bd_pins pci_size] [get_bd_pins rdmx_to_pci/pci_size]
connect_bd_net [get_bd_pins pcie_bridge/axi_aclk] \
  [get_bd_pins axi_aclk] [get_bd_pins axi_crossbar/aclk] [get_bd_pins axis_register_slice/aclk] \
  [get_bd_pins axis_throttle/clk] [get_bd_pins rdmx_to_pci/clk] [get_bd_pins system_ila/clk] [get_bd_pins axi4_lite_plug/clk]
connect_bd_net [get_bd_pins pcie_bridge/axi_aresetn] [get_bd_pins axi_aresetn]
connect_bd_net -net rdmx_to_pci_pci_range_err [get_bd_pins rdmx_to_pci/pci_range_err_strb] [get_bd_pins pci_range_err_strb]
connect_bd_net [get_bd_pins resetn_in] [get_bd_pins axi_crossbar/aresetn] [get_bd_pins axis_register_slice/aresetn] [get_bd_pins rdmx_to_pci/resetn]
connect_bd_net -net util_ds_buf_0_IBUF_DS_ODIV2 [get_bd_pins util_ds_buf/IBUF_DS_ODIV2] [get_bd_pins pcie_bridge/sys_clk]
connect_bd_net -net util_ds_buf_0_IBUF_OUT [get_bd_pins util_ds_buf/IBUF_OUT] [get_bd_pins pcie_bridge/sys_clk_gt]

current_bd_instance /system_interconnect
connect_bd_intf_net [get_bd_intf_pins S00_AXI] [get_bd_intf_pins system_interconnect/S00_AXI]
connect_bd_intf_net [get_bd_intf_pins axi_revision/S_AXI] [get_bd_intf_pins system_interconnect/M00_AXI]
connect_bd_intf_net [get_bd_intf_pins M01_AXI] [get_bd_intf_pins system_interconnect/M01_AXI]
connect_bd_net -net pcie_bridge_axi_aclk [get_bd_pins aclk] [get_bd_pins axi_revision/AXI_ACLK] [get_bd_pins system_interconnect/aclk]
connect_bd_net -net pcie_bridge_axi_aresetn [get_bd_pins aresetn] [get_bd_pins axi_revision/AXI_ARESETN] [get_bd_pins system_interconnect/aresetn]

current_bd_instance /channel_0
connect_bd_intf_net [get_bd_intf_pins axis_pcie_out] [get_bd_intf_pins packet_buffer/axis_pcie_out]
connect_bd_intf_net [get_bd_intf_pins axis_pcie_out] [get_bd_intf_pins control/seq_axis]
connect_bd_intf_net [get_bd_intf_pins packet_buffer/axis_in] [get_bd_intf_pins qsfp/axis_rx]
connect_bd_intf_net [get_bd_intf_pins SRC_AXI] [get_bd_intf_pins host_ram_to_rdmx/SRC_AXI]
connect_bd_intf_net [get_bd_intf_pins qsfp0_clk] [get_bd_intf_pins qsfp/gt_ref_clk]
connect_bd_intf_net [get_bd_intf_pins hbm_refclk] [get_bd_intf_pins packet_buffer/hbm_refclk]
connect_bd_intf_net [get_bd_intf_pins packet_buffer/axis_qsfp_out] [get_bd_intf_pins qsfp/axis_loopback]
connect_bd_intf_net [get_bd_intf_pins qsfp0_gt] [get_bd_intf_pins qsfp/gt_serial_port]
connect_bd_intf_net [get_bd_intf_pins host_ram_to_rdmx/AXIS_TX] [get_bd_intf_pins qsfp/axis_xmit]
connect_bd_intf_net [get_bd_intf_pins S_AXI] [get_bd_intf_pins control/S_AXI]
connect_bd_net -net abm_sender_idle [get_bd_pins host_ram_to_rdmx/idle] [get_bd_pins control/xmit_idle]
connect_bd_net -net byte_count_1 [get_bd_pins control/xmit_byte_count] [get_bd_pins host_ram_to_rdmx/byte_count]
connect_bd_net [get_bd_pins control/gen_packets] [get_bd_pins qsfp/gen_packets]
connect_bd_net [get_bd_pins control/loopback] [get_bd_pins packet_buffer/loopback_mode] [get_bd_pins qsfp/loopback_mode]
connect_bd_net [get_bd_pins control/packet_count] [get_bd_pins qsfp/max_packets]
connect_bd_net [get_bd_pins control/resetn_out] \
  [get_bd_pins resetn_out] [get_bd_pins packet_buffer/resetn] [get_bd_pins qsfp/resetn] [get_bd_pins host_ram_to_rdmx/resetn]
connect_bd_net -net dst_address_1 [get_bd_pins control/xmit_dst_addr] [get_bd_pins host_ram_to_rdmx/dst_address]
connect_bd_net [get_bd_pins packet_buffer/bad_packet_strb] [get_bd_pins control/bad_packet_strb]
connect_bd_net [get_bd_pins packet_buffer/good_packet_strb] [get_bd_pins control/good_packet_strb]
connect_bd_net [get_bd_pins packet_buffer/hbm_cattrip] [get_bd_pins control/async_hbm_cattrip]
connect_bd_net [get_bd_pins packet_buffer/hbm_temp] [get_bd_pins control/async_hbm_temp]
connect_bd_net [get_bd_pins packet_buffer/hwm_0] [get_bd_pins control/hwm_0]
connect_bd_net [get_bd_pins packet_buffer/hwm_1] [get_bd_pins control/hwm_1]
connect_bd_net [get_bd_pins packet_buffer/overflow_0] [get_bd_pins control/overflow_0]
connect_bd_net [get_bd_pins packet_buffer/overflow_1] [get_bd_pins control/overflow_1]
connect_bd_net -net pause_pci_1 [get_bd_pins control/pause_pci] [get_bd_pins pause_pci]
connect_bd_net -net pci_base_1 [get_bd_pins control/pci_base] [get_bd_pins pci_base]
connect_bd_net -net pci_size_1 [get_bd_pins control/pci_size] [get_bd_pins pci_size]
connect_bd_net -net pcie_bridge_axi_aclk [get_bd_pins clk] \
  [get_bd_pins packet_buffer/clk] [get_bd_pins qsfp/clk] [get_bd_pins host_ram_to_rdmx/clk] [get_bd_pins control/clk]
connect_bd_net -net pcie_bridge_axi_aresetn [get_bd_pins resetn] [get_bd_pins control/resetn]
connect_bd_net -net pcie_bridge_pci_range_err_strb [get_bd_pins pci_range_err_strb] [get_bd_pins control/pci_range_err_strb]
connect_bd_net [get_bd_pins qsfp/gen_idle] [get_bd_pins control/generator_idle]
connect_bd_net [get_bd_pins qsfp/rx_aligned] [get_bd_pins control/async_pcs_aligned]
connect_bd_net [get_bd_pins qsfp/status_leds] [get_bd_pins qsfp0_leds]
connect_bd_net -net src_address_1 [get_bd_pins control/xmit_src_addr] [get_bd_pins host_ram_to_rdmx/src_address]
connect_bd_net -net start_1 [get_bd_pins control/xmit_start] [get_bd_pins host_ram_to_rdmx/start]

current_bd_instance /channel_0/host_ram_to_rdmx
connect_bd_intf_net [get_bd_intf_pins rdmx_xmit/S_AXI] [get_bd_intf_pins dma_pci_to_rdmx/DST_AXI]
connect_bd_intf_net [get_bd_intf_pins SRC_AXI] [get_bd_intf_pins dma_pci_to_rdmx/SRC_AXI]
connect_bd_intf_net [get_bd_intf_pins AXIS_TX] [get_bd_intf_pins rdmx_xmit/AXIS_TX]
connect_bd_net [get_bd_pins byte_count] [get_bd_pins dma_pci_to_rdmx/byte_count]
connect_bd_net -net control_resetn_out1 [get_bd_pins resetn] [get_bd_pins rdmx_xmit/src_resetn] [get_bd_pins dma_pci_to_rdmx/resetn]
connect_bd_net [get_bd_pins dma_pci_to_rdmx/idle] [get_bd_pins idle]
connect_bd_net [get_bd_pins dst_address] [get_bd_pins dma_pci_to_rdmx/dst_address]
connect_bd_net -net pcie_bridge_axi_aclk [get_bd_pins clk] \
  [get_bd_pins rdmx_xmit/src_clk] [get_bd_pins rdmx_xmit/dst_clk] [get_bd_pins dma_pci_to_rdmx/clk]
connect_bd_net [get_bd_pins src_address] [get_bd_pins dma_pci_to_rdmx/src_address]
connect_bd_net [get_bd_pins start] [get_bd_pins dma_pci_to_rdmx/start]

current_bd_instance /channel_0/packet_buffer
connect_bd_intf_net [get_bd_intf_pins axis_pcie_out] [get_bd_intf_pins output_axis_switch/axis_out0]
connect_bd_intf_net [get_bd_intf_pins axis_in] [get_bd_intf_pins bad_packet_filter/AXIS_IN]
connect_bd_intf_net [get_bd_intf_pins data_buffer/AXIS_IN0] [get_bd_intf_pins input_axis_switch/axis_out0]
connect_bd_intf_net [get_bd_intf_pins data_buffer/AXIS_IN1] [get_bd_intf_pins input_axis_switch/axis_out1]
connect_bd_intf_net [get_bd_intf_pins input_axis_switch/axis_in] [get_bd_intf_pins bad_packet_filter/AXIS_OUT]
connect_bd_intf_net [get_bd_intf_pins output_axis_switch/axis_in] [get_bd_intf_pins data_buffer/axis_out]
connect_bd_intf_net [get_bd_intf_pins hbm_refclk] [get_bd_intf_pins data_buffer/hbm0_refclk]
connect_bd_intf_net [get_bd_intf_pins axis_qsfp_out] [get_bd_intf_pins output_axis_switch/axis_out1]
connect_bd_net [get_bd_pins bad_packet_filter/bad_packet_strb] [get_bd_pins bad_packet_strb]
connect_bd_net -net channel_0_high_water_mark [get_bd_pins data_buffer/hwm_0] [get_bd_pins hwm_0]
connect_bd_net -net channel_0_overflow [get_bd_pins data_buffer/overflow_0] [get_bd_pins overflow_0]
connect_bd_net -net channel_0_ram_reader_idle [get_bd_pins data_buffer/ram_reader_idle0] [get_bd_pins switch_ctrl/ram_reader_idle0]
connect_bd_net -net channel_1_high_water_mark [get_bd_pins data_buffer/hwm_1] [get_bd_pins hwm_1]
connect_bd_net -net channel_1_idle [get_bd_pins data_buffer/ram_reader_idle1] [get_bd_pins switch_ctrl/ram_reader_idle1]
connect_bd_net -net channel_1_overflow [get_bd_pins data_buffer/overflow_1] [get_bd_pins overflow_1]
connect_bd_net [get_bd_pins input_axis_switch/packet_strb] [get_bd_pins good_packet_strb]
connect_bd_net -net pcie_bridge_axi_aclk [get_bd_pins clk] \
  [get_bd_pins input_axis_switch/clk] [get_bd_pins output_axis_switch/clk] [get_bd_pins switch_ctrl/clk] \
  [get_bd_pins data_buffer/clk] [get_bd_pins bad_packet_filter/clk]
connect_bd_net -net port_select_1 [get_bd_pins loopback_mode] [get_bd_pins output_axis_switch/port_select]
connect_bd_net -net ram_hbm_cattrip [get_bd_pins data_buffer/hbm_cattrip] [get_bd_pins hbm_cattrip]
connect_bd_net -net ram_hbm_temp [get_bd_pins data_buffer/hbm_temp] [get_bd_pins hbm_temp]
connect_bd_net [get_bd_pins resetn] [get_bd_pins switch_ctrl/resetn] [get_bd_pins data_buffer/resetn] [get_bd_pins bad_packet_filter/resetn]
connect_bd_net -net start_ram_reader_0 [get_bd_pins switch_ctrl/ram_reader_start0] [get_bd_pins data_buffer/start_ram_reader0]
connect_bd_net -net stream_to_ram_0_done [get_bd_pins data_buffer/inflow_done0] [get_bd_pins switch_ctrl/inflow_done0]
connect_bd_net -net stream_to_ram_0_has_data [get_bd_pins data_buffer/has_data0] [get_bd_pins switch_ctrl/has_data0]
connect_bd_net -net stream_to_ram_1_done [get_bd_pins data_buffer/inflow_done1] [get_bd_pins switch_ctrl/inflow_done1]
connect_bd_net -net stream_to_ram_1_has_data [get_bd_pins data_buffer/has_data1] [get_bd_pins switch_ctrl/has_data1]
connect_bd_net -net switch_ctrl_0_inflow_q [get_bd_pins switch_ctrl/inflow_q] \
  [get_bd_pins input_axis_switch/port_select] [get_bd_pins data_buffer/inflow_q]
connect_bd_net [get_bd_pins switch_ctrl/ram_reader_start1] [get_bd_pins data_buffer/start_ram_reader1]
